# EAGLE design mwscoretransponder2017 (EAGLE 8.0.1)
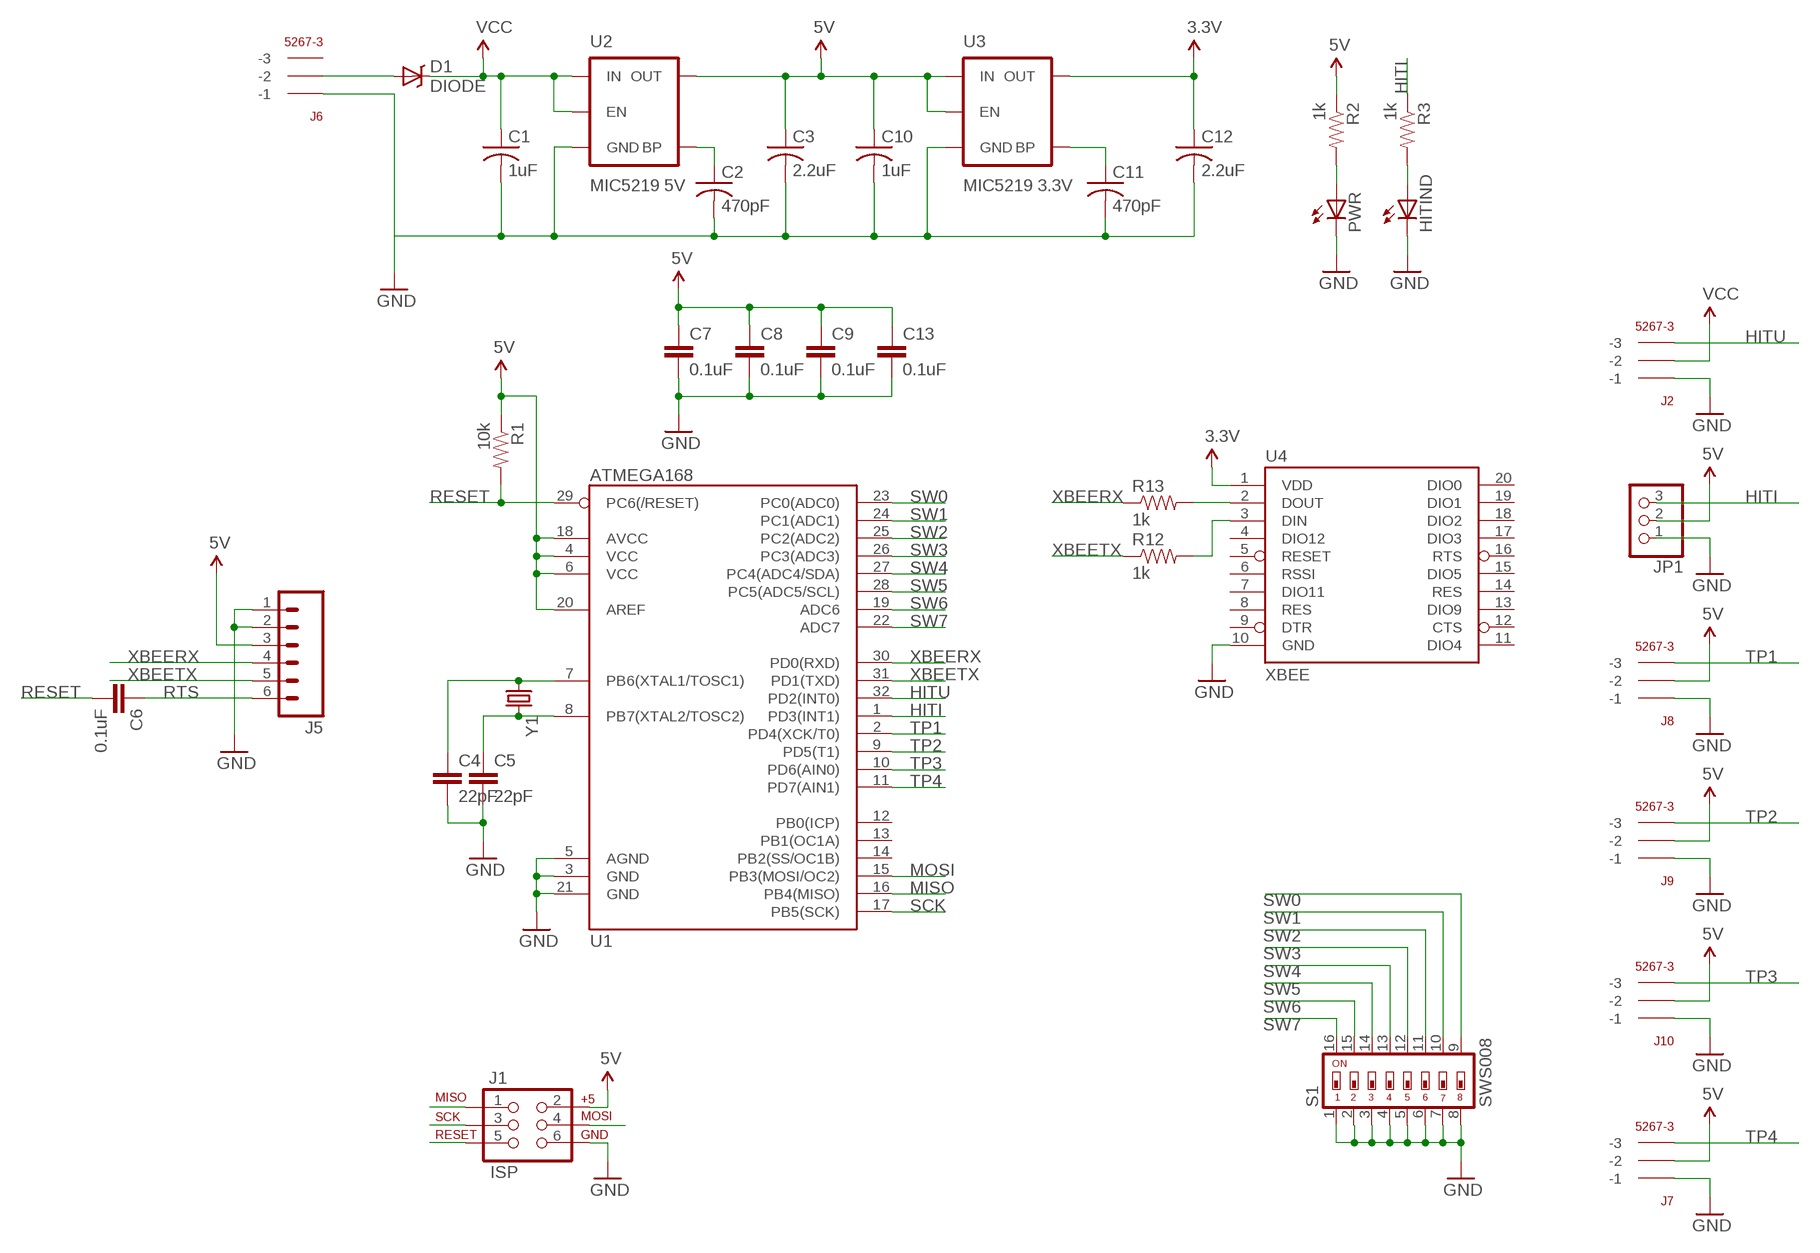
[diagram p0: schematic, sheet 1]

## Parts
C1  1uF  C-USC0603  [C0603]
C2  470pF  C-USC0603  [C0603]
C3  2.2uF  C-USC0805  [C0805]
C4  22pF  CAP0603-CAP  [0603-CAP]
C5  22pF  CAP0603-CAP  [0603-CAP]
C6  0.1uF  CAP0603-CAP  [0603-CAP]
C7  0.1uF  CAP0603-CAP  [0603-CAP]
C8  0.1uF  CAP0603-CAP  [0603-CAP]
C9  0.1uF  CAP0603-CAP  [0603-CAP]
C10  1uF  C-USC0603  [C0603]
C11  470pF  C-USC0603  [C0603]
C12  2.2uF  C-USC0805  [C0805]
C13  0.1uF  CAP0603-CAP  [0603-CAP]
D1  DIODE  DIODE-SCHOTTKY_  [SMA-DIODE]
HITIND  LED0603  [LED-0603]
J1  ISP  AVR_SPI_PRG_6PTH  [2X3]
J2  5267-3  [5267-3]
J5  M06SIP  [1X06]
J6  5267-3  [5267-3]
J7  5267-3  [5267-3]
J8  5267-3  [5267-3]
J9  5267-3  [5267-3]
J10  5267-3  [5267-3]
JP1  PINHD-1X3  [1X03]
PWR  LED0603  [LED-0603]
R1  10k  RESISTOR0603-RES  [0603-RES]
R2  1k  RESISTOR0603-RES  [0603-RES]
R3  1k  RESISTOR0603-RES  [0603-RES]
R12  1k  RESISTOR0603-RES  [0603-RES]
R13  1k  RESISTOR0603-RES  [0603-RES]
S1  SWS008  [SMS-008]
U1  ATMEGA168  [TQFP32-08]
U2  MIC5219 5V  V_REG_MIC52195V  [SOT23-5]
U3  MIC5219 3.3V  V_REG_MIC52193.3V  [SOT23-5]
U4  XBEE  XBEE-1B3  [XBEE-SMD]
Y1  CRYSTAL5X3  [CRYSTAL-SMD-5X3]

## Nets
3.3V: C12.1 U3.5(OUT) U4.1(VDD)
5V: C3.1 C7.1 C8.1 C9.1 C10.1 C13.1 J1.2 J5.3 J7.P$2(-2) J8.P$2(-2) J9.P$2(-2) J10.P$2(-2) JP1.2 R1.1 R2.1 U1.4(VCC) U1.6(VCC) U1.18(AVCC) U1.20(AREF) U2.5(OUT) U3.1(IN) U3.3(EN)
GND: C1.2 C2.2 C3.2 C4.2 C5.2 C7.2 C8.2 C9.2 C10.2 C11.2 C12.2 C13.2 HITIND.C J1.6 J2.P$1(-1) J5.1 J5.2 J6.P$1(-1) J7.P$1(-1) J8.P$1(-1) J9.P$1(-1) J10.P$1(-1) JP1.1 PWR.C S1.1 S1.2 S1.3 S1.4 S1.5 S1.6 S1.7 S1.8 U1.3(GND) U1.5(AGND) U1.21(GND) U2.2(GND) U3.2(GND) U4.10(GND)
HITI: JP1.3 R3.1 U1.1(PD3(INT1))
HITU: J2.P$3(-3) U1.32(PD2(INT0))
MISO: J1.1 U1.16(PB4(MISO))
MOSI: J1.4 U1.15(PB3(MOSI/OC2))
N$1: PWR.A R2.2
N$2: HITIND.A R3.2
N$3: C4.1 U1.7(PB6(XTAL1/TOSC1)) Y1.1
N$4: D1.A J6.P$2(-2)
N$6: C5.1 U1.8(PB7(XTAL2/TOSC2)) Y1.3
N$7: R13.2 U4.2(DOUT)
N$8: R12.2 U4.3(DIN)
N$9: C11.1 U3.4(BP)
N$11: C2.1 U2.4(BP)
RESET: C6.2 J1.5 R1.2 U1.29(PC6(/RESET))
RTS: C6.1 J5.6
SCK: J1.3 U1.17(PB5(SCK))
SW0: S1.9 U1.23(PC0(ADC0))
SW1: S1.10 U1.24(PC1(ADC1))
SW2: S1.11 U1.25(PC2(ADC2))
SW3: S1.12 U1.26(PC3(ADC3))
SW4: S1.13 U1.27(PC4(ADC4/SDA))
SW5: S1.14 U1.28(PC5(ADC5/SCL))
SW6: S1.15 U1.19(ADC6)
SW7: S1.16 U1.22(ADC7)
TP1: J8.P$3(-3) U1.2(PD4(XCK/T0))
TP2: J9.P$3(-3) U1.9(PD5(T1))
TP3: J10.P$3(-3) U1.10(PD6(AIN0))
TP4: J7.P$3(-3) U1.11(PD7(AIN1))
VCC: C1.1 D1.C J2.P$2(-2) U2.1(IN) U2.3(EN)
XBEERX: J5.4 R13.1 U1.30(PD0(RXD))
XBEETX: J5.5 R12.1 U1.31(PD1(TXD))
Unconnected: J6.P$3(-3) U1.12(PB0(ICP)) U1.13(PB1(OC1A)) U1.14(PB2(SS/OC1B)) U4.4(DIO12) U4.5(RESET) U4.6(RSSI) U4.7(DIO11) U4.8(RES) U4.9(DTR) U4.11(DIO4) U4.12(CTS) U4.13(DIO9) U4.14(RES) U4.15(DIO5) U4.16(RTS) U4.17(DIO3) U4.18(DIO2) U4.19(DIO1) U4.20(DIO0)

## Library data of the parts
C1-C3 C10-C12 = rcl:C-US: CAPACITOR, American symbol
C4-C9 C13 = SparkFun:CAP: Capacitor Standard 0603 ceramic capacitor, and 0.1" leaded capacitor.
D1 = SparkFun:DIODE-SCHOTTKY
HITIND PWR = SparkFun:LED: LEDs Standard schematic elements and footprints for 5mm, 3mm, 1206, and 0603 sized LEDs. 5mm - Spark Fun Electronics SKU : COM-00529 (and others)
J1 = SparkFun:AVR_SPI_PRG_6: AVR ISP 6 Pin This is the reduced ISP connector for AVR programming. Common on Arduino. This footprint will take up less PCB space and can be used with a 10-pin to 6-pin adapter such as SKU: BOB-08508
J2 J6-J10 = con-molex-spox:5267-3
J5 = SparkFun:M06: Header 6 Standard 6-pin 0.1" header. Use with straight break away headers (SKU : PRT-00116), right angle break away headers (PRT-00553), swiss pins (PRT-00743), machine pins (PRT-00117), and female headers (PRT-00115). Molex polarized connector foot print use with SKU : PRT-08094 with associated crimp pins and housings. NOTES ON THE VARIANTS LOCK and LOCK_LONGPADS... This footprint was designed to help hold the alignment of a through-hole component (i.e. 6-pin header) while soldering it into place. You may notice that each hole has been shifted either up or down by 0.005 of an inch from it's more standard position (which is a perfectly straight line). This slight alteration caused the pins (the squares in the middle) to touch the edges of the holes. Because they are alternating, it causes a "brace" to hold the component in place. 0.005 has proven to be the perfect amount of "off-center" position when using our standard breakaway headers. Although looks a little odd when you look at the bare footprint, once you have a header in there, the alteration is very hard to notice. Also, if you push a header all the way into place, it is covered up entirely on the bottom side. This idea of altering the position of holes to aid alignment will be further integrated into the Sparkfun Library for other footprints. It can help hold any component with 3 or more connection pins.
JP1 = pinhead:PINHD-1X3: PIN HEADER
R1-R3 R12 R13 = SparkFun:RESISTOR: Resistor Basic schematic elements and footprints for 0603, 1206, and PTH resistors.
S1 = smd-special:SWS008: SMD Dip Switch 8 pol.
U1 = SparkFun:ATMEGA168
U2 = SparkFun-PowerIC:V_REG_MIC5219: V_REG MIC5219 Standard 3.3V and 5V 500mA LDO voltage regulator in SOT-23 layout. Micrel part MIC5219. BP (by-pass) pin is used to lower output noise with 470pF cap, may be left open.; PROD_ID: VREG-10107
U3 = SparkFun-PowerIC:V_REG_MIC5219: V_REG MIC5219 Standard 3.3V and 5V 500mA LDO voltage regulator in SOT-23 layout. Micrel part MIC5219. BP (by-pass) pin is used to lower output noise with 470pF cap, may be left open.; PROD_ID: VREG-09872
U4 = SparkFun:XBEE-1
Y1 = SparkFun:CRYSTAL: Crystals Various standard crystals. Proven footprints. Spark Fun Electronics SKU : COM-00534

## Board
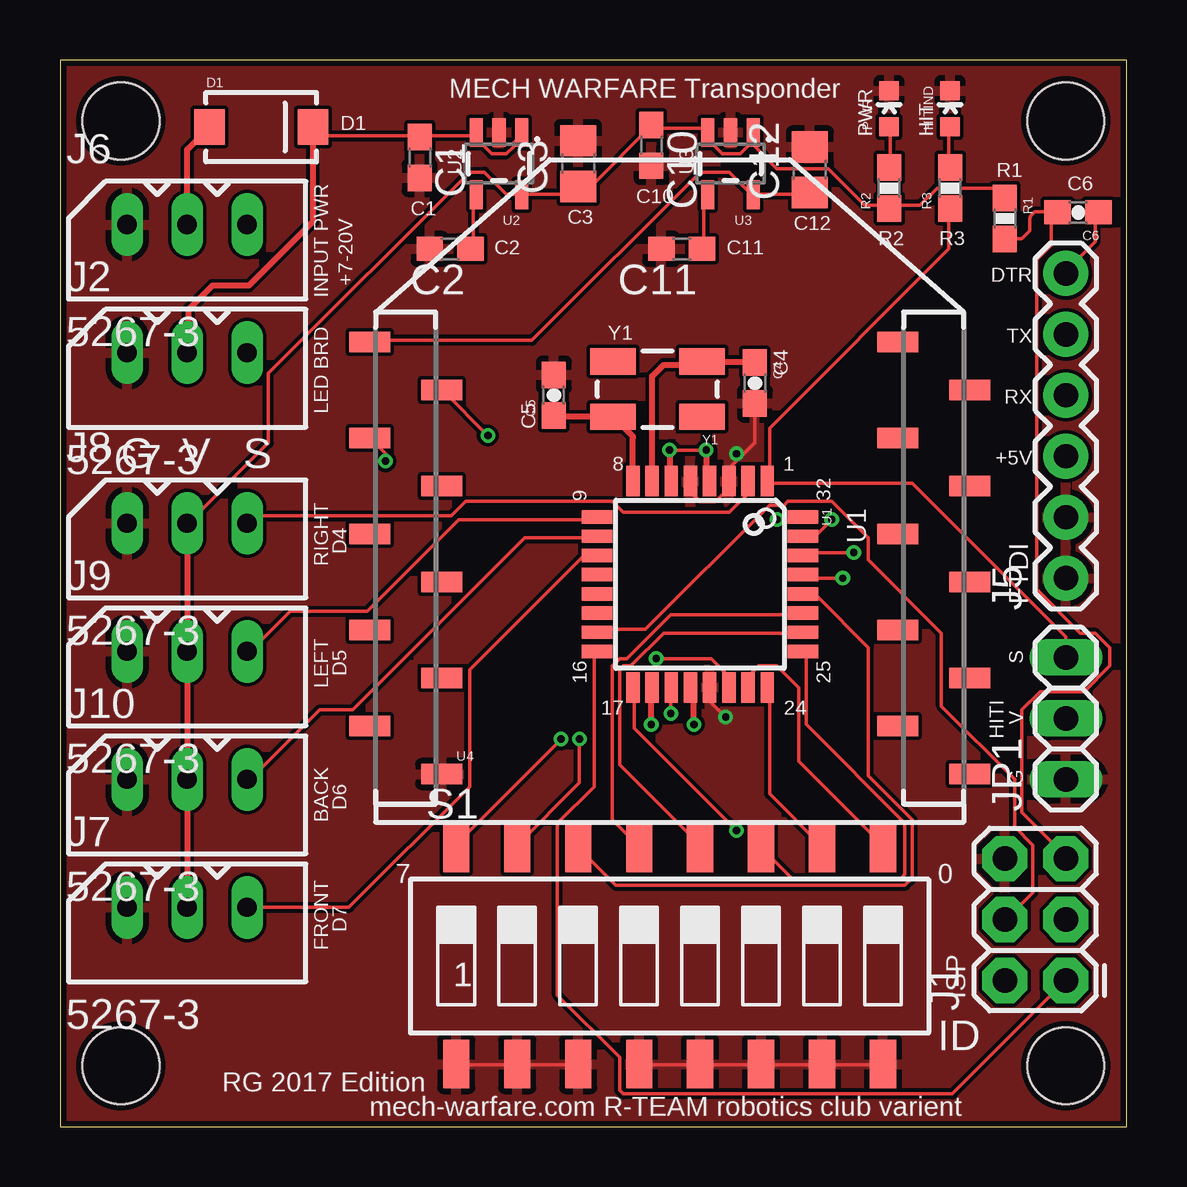
[diagram p1: board, top side]
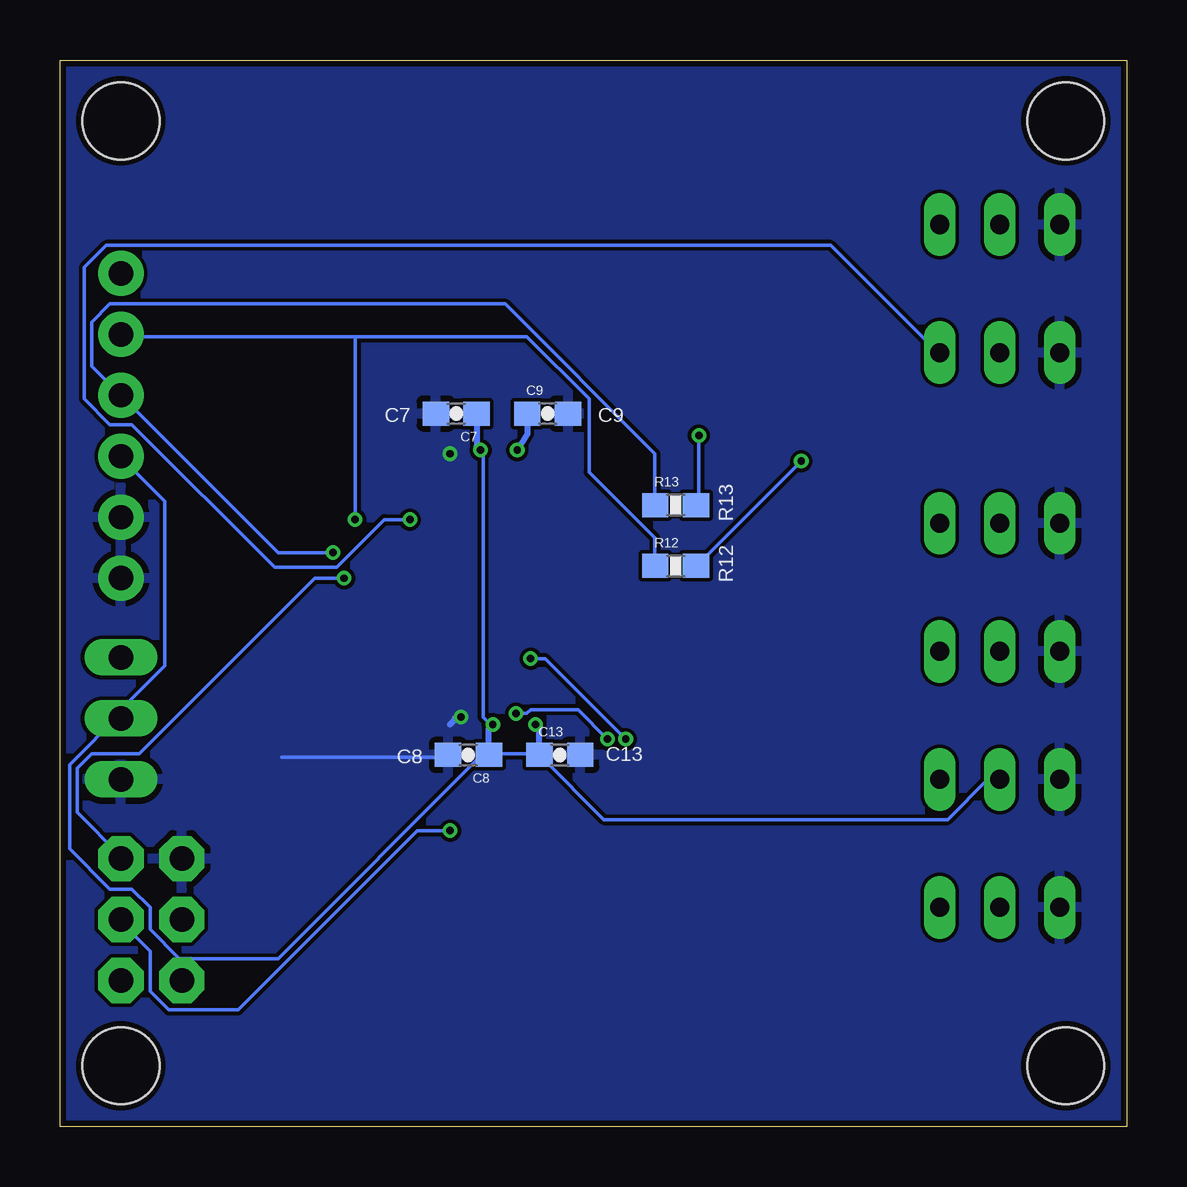
[diagram p2: board, bottom side, seen from below]

Size 44.45 x 44.45 mm. Coordinates in mm from the lower left corner, seen from the top.
Outline: 0,0 44.45,0 44.45,44.45 0,44.45 0,0
Copper layers (1*16): Top 0.035mm / dielectric 1.5mm / Bottom 0.035mm
Design rules "default": minimum track width 6mil, minimum drill 12mil, track to track 6mil, track to pad 6mil, pad to pad 6mil, via to via 6mil, smd to smd 0mil, copper to edge 10mil, drill to drill 10mil, minimum pad ring 10mil, minimum via ring 6mil, stop-mask expansion 2mil, vias tented up to drill 100mil, thermal gap 10mil
Holes 3.2 mm at 2.54,2.54 41.91,2.54 2.54,41.91 41.91,41.91

### Footprints (pad centres in the part's own frame; a part is rotated, then mirrored left to right if it is on the bottom)
C0603 = smd 1.1 x 1: 1 -0.85,0; 2 0.85,0
C0805 = smd 1.3 x 1.5: 1 -0.95,0; 2 0.95,0
0603-CAP = smd 1.1 x 1: 1 -0.85,0; 2 0.85,0
SMA-DIODE = smd 1.27 x 1.47: A -2.15,0; C 2.15,0
LED-0603 = smd 0.8 x 0.8: A 0,-0.75; C 0,0.75
2X3 = drill 1.016 pad 1.88 octagon: 1 0,0; 2 0,2.54; 3 2.54,0; 4 2.54,2.54; 5 5.08,0; 6 5.08,2.54
5267-3 = drill 0.8 long: P$1 0,0; P$2 2.5,0; P$3 5,0
1X06 = drill 1.016 pad 1.88: 1 0,0; 2 2.54,0; 3 5.08,0; 4 7.62,0; 5 10.16,0; 6 12.7,0
1X03 = drill 1.016 long: 1 -2.54,0; 2 0,0; 3 2.54,0
0603-RES = smd 1.1 x 1: 1 -0.85,0; 2 0.85,0
SMS-008 = smd 1.092 x 2.007: 1 -8.89,-4.496; 2 -6.35,-4.496; 3 -3.81,-4.496; 4 -1.27,-4.496; 5 1.27,-4.496; 6 3.81,-4.496; 7 6.35,-4.496; 8 8.89,-4.496; 9 8.89,4.496; 10 6.35,4.496; 11 3.81,4.496; 12 1.27,4.496; 13 -1.27,4.496; 14 -3.81,4.496; 15 -6.35,4.496; 16 -8.89,4.496
TQFP32-08 = smd 1.27 x 0.559: 1 -4.293,2.8; 2 -4.293,2; 3 -4.293,1.2; 4 -4.293,0.4; 5 -4.293,-0.4; 6 -4.293,-1.2; 7 -4.293,-2; 8 -4.293,-2.8; 17 4.293,-2.8; 18 4.293,-2; 19 4.293,-1.2; 20 4.293,-0.4; 21 4.293,0.4; 22 4.293,1.2; 23 4.293,2; 24 4.293,2.8 | smd 0.559 x 1.27: 9 -2.8,-4.293; 10 -2,-4.293; 11 -1.2,-4.293; 12 -0.4,-4.293; 13 0.4,-4.293; 14 1.2,-4.293; 15 2,-4.293; 16 2.8,-4.293; 25 2.8,4.293; 26 2,4.293; 27 1.2,4.293; 28 0.4,4.293; 29 -0.4,4.293; 30 -1.2,4.293; 31 -2,4.293; 32 -2.8,4.293
SOT23-5 = smd 0.55 x 1.2: 1 -0.95,-1.3; 2 0,-1.3; 3 0.95,-1.3; 4 0.95,1.3; 5 -0.95,1.3
XBEE-SMD = smd 1.7 x 0.85: 1 -12.5,20; 2 -9.5,18; 3 -12.5,16; 4 -9.5,14; 5 -12.5,12; 6 -9.5,10; 7 -12.5,8; 8 -9.5,6; 9 -12.5,4; 10 -9.5,2; 11 12.5,2; 12 9.5,4; 13 12.5,6; 14 9.5,8; 15 12.5,10; 16 9.5,12; 17 12.5,14; 18 9.5,16; 19 12.5,18; 20 9.5,20
CRYSTAL-SMD-5X3 = smd 1.9 x 1.1: 1 -1.85,-1.15; 2 1.85,-1.15; 3 1.85,1.15; 4 -1.85,1.15

### Placement (x,y rotation side)
C1  14.99,40.39 270 top
C2  16.26,36.58 180 top
C3  21.59,40.13 90 top
C4  28.96,30.99 270 top
C5  20.57,30.48 90 top
C6  42.42,38.1 180 top
C7  27.94,29.72 180 bottom
C8  27.43,15.49 180 bottom
C9  24.13,29.72 0 bottom
C10  24.64,40.89 270 top
C11  25.91,36.58 180 top
C12  31.24,39.88 90 top
C13  23.62,15.49 0 bottom
D1  8.38,41.66 0 top
HITIND  37.08,42.42 0 top
J1  41.91,6.1 90 top
J2  2.79,32.26 0 top
J5  41.91,22.86 90 top
J6  2.79,37.59 0 top
J7  2.79,9.14 0 top
J8  2.79,25.15 0 top
J9  2.79,19.81 0 top
J10  2.79,14.48 0 top
JP1  41.91,17.02 90 top
PWR  34.54,42.42 0 top
R1  39.37,37.85 270 top
R2  34.54,39.12 90 top
R3  37.08,39.12 90 top
R12  18.8,23.37 0 bottom
R13  18.8,25.91 0 bottom
S1  25.4,7.11 0 top
U1  26.67,22.61 270 top
U2  18.29,40.13 180 top
U3  27.94,40.13 180 top
U4  25.4,12.7 0 top
Y1  24.89,30.73 180 top

### Tracks (layer width: path | path; a pad name or v marks a point on that pad's centre or on a via)
3.3V
  Top 0.152: C12.1 31.24,38.86 28.96,38.86 U3.5 28.8,38.86 27.89,39.78 26.67,39.78 19.66,32.77 12.95,32.77 U4.1
5V  (via drill 0.3)
  Top 0.152: 28.8,41 28.8,41.3 U3.1 28.8,41 | 28.8,41 28.35,40.54 27.58,40.54 27.13,41 27.13,41.3 U3.3 26.98,41.45 26.82,41.6 24.69,41.6 C10.1 24.54,41.6 22.25,39.32 21.64,39.32 C3.1 21.49,39.17 21.18,38.86 19.36,38.86 U2.5 19.2,38.86 18.59,38.86 17.68,39.78 17.07,39.78 8.69,31.39 8.69,28.5 5.33,25.15 J8.P$2 | 28.8,41 29.87,39.93 32,39.93 33.53,38.41 34.44,38.41 R2.1 34.59,38.41 35.81,38.41 36.55,39.12 38.79,39.12 arc-45 38.97,39.04 R1.1 | v25.4,28.19 v26.92,28.19
  Top 0.254: J8.P$2 J9.P$2 J10.P$2 J7.P$2 | v26.42,16.76 26.42,18.17 U1.20 | v24.64,16.76 24.64,18.28 U1.18 | v25.4,28.19 25.4,26.97 U1.6 | v26.92,28.19 26.92,27.05 U1.4
  Bottom 0.152: v26.92,28.19 26.82,28.19 26.82,17.07 26.52,16.76 v26.42,16.76 | 41.91,17.22 41.91,17.37 40.08,19.2 40.08,26.06 41.91,27.89 J5.3 | 41.91,17.22 JP1.2 41.91,17.07 | 39.47,7.01 39.47,6.1 J1.2 39.47,7.01 | 39.47,7.01 40.69,8.23 40.69,9.14 41.45,9.91 42.37,9.91 44.04,11.58 44.04,15.09 41.91,17.22 | 39.47,7.01 35.36,7.01 26.98,15.39 26.67,15.39 C8.1 26.52,15.54 24.54,15.54 C13.1 24.38,15.39 21.79,12.8 7.47,12.8 5.79,14.48 J10.P$2
  Bottom 0.254: C8.1 26.58,16.6 v26.42,16.76 | C13.1 24.47,16.6 v24.64,16.76 | C9.1 24.98,28.87 v25.4,28.19 | C7.1 27.09,28.36 v26.92,28.19
GND  (via drill 0.3)
  Top 0.152: 15.85,14.78 U4.10 | U1.5 26.04,26.67 26.67,26.04 27.3,26.04 27.94,26.67 27.9,26.83 | 27.9,26.83 27.88,26.91 | C4.2 28.96,28.5 28.35,27.89 | 28.35,27.89 27.89,27.43 27.89,26.98 U1.3 27.89,26.82 27.9,26.83 | v27.74,17.07 27.13,17.68 27.13,18.29 U1.21 | 26.67,2.59 24.23,2.59 S1.4 | S1.8 34.29,2.59 31.85,2.59 S1.7 31.7,2.59 29.26,2.59 S1.6 29.11,2.59 26.67,2.59 | 26.67,2.59 S1.5 | v28.19,28.04 28.35,27.89 | 19.05,2.59 16.61,2.59 S1.1 | 19.05,2.59 21.49,2.59 S1.3 | 19.05,2.59 S1.2
  Bottom 0.152: v27.74,17.07 27.89,17.07 27.94,17.02 | 28.04,17.07 27.96,16.99 | 35.2,15.39 28.35,15.39 C8.2 | 39.32,11.28 J1.6 | 28.04,28.04 v28.19,28.04
  Bottom 0.254: 27.94,17.02 27.96,16.99 28.19,16.76 | 28.19,15.58 C8.2
  pour Bottom: -0.25,44.7 44.96,44.7 44.96,-0.51 -0.25,-0.51
  pour Top: -0.25,44.7 44.7,44.7 44.7,-0.25 -0.25,-0.25
HITI
  Top 0.152: R3.1 37.03,38.25 37.03,36.58 29.57,29.11 29.57,26.98 U1.1 29.57,26.82 35.51,26.82 41.91,20.42 JP1.3
HITU  (via drill 0.3)
  Top 0.152: v29.87,25.3 30.94,25.3 U1.32
  Bottom 0.152: v29.87,25.3 30.94,25.3 32.92,23.32 35.51,23.32 41.45,29.26 42.37,29.26 43.43,30.33 43.43,35.81 42.52,36.73 12.34,36.73 7.92,32.31 J2.P$3
MISO
  Top 0.152: J1.1 37.19,1.37 23.47,1.37 23.32,1.52 23.32,2.9 20.73,5.49 20.73,12.65 22.25,14.17 22.25,19.66 U1.16
MOSI
  Top 0.152: U1.15 22.4,20.73 24.38,20.73 29.57,25.91 30.18,25.91 30.33,26.06 32.16,26.06 33.68,24.54 33.68,23.62 36.73,20.57 36.73,17.53 39.78,14.48 39.78,12.5 40.54,11.73 40.54,9.75 39.47,8.69 J1.4
N$1
  Top 0.152: PWR.A 34.59,41.6 34.59,40.08 R2.2
N$2
  Top 0.152: HITIND.A 37.03,41.6 37.03,40.08 R3.2
N$3
  Top 0.254: U1.7 24.67,31.27 25.15,31.75 26.61,31.75 Y1.1 28.91,31.88 C4.1
N$4
  Top 0.254: J6.P$2 5.29,40.72 D1.A
N$6
  Top 0.254: U1.8 23.87,28.7 23.88,28.7 23.88,28.75 Y1.3 20.62,29.58 C5.1
N$7  (via drill 0.3)
  Top 0.152: v17.83,28.8 16,30.63 U4.2
  Bottom 0.152: v17.83,28.8 17.83,25.91 R13.2
N$8  (via drill 0.3)
  Top 0.152: v13.56,27.74 13.56,28.04 12.95,28.65 U4.3
  Bottom 0.152: v13.56,27.74 17.83,23.47 R12.2
N$9
  Top 0.152: C11.1 26.82,36.58 26.82,38.56 26.98,38.71 U3.4
N$11
  Top 0.152: C2.1 17.22,36.58 17.22,38.71 U2.4
RESET  (via drill 0.3)
  Top 0.152: v32.61,22.86 31.09,22.86 U1.29 | C6.2 41.3,38.1 41.3,36.73 40.69,36.12 40.69,22.4 42.52,20.57 43.13,20.57 43.74,19.96 43.74,19.2 42.67,18.14 40.84,18.14 40.08,17.37 40.08,13.11 41.91,11.28 J1.5 | R1.2 39.96,37 arc45 40.14,37.07 40.41,37.34 40.41,37.82 arc-45 40.49,38 40.62,38.12 41.51,38.12
  Top 0.254: 41.51,38.12 arc-45 C6.2
  Bottom 0.152: v32.61,22.86 33.83,22.86 41.15,15.54 43.13,15.54 43.74,14.94 43.74,13.11 41.91,11.28 J1.5
RTS
  Top 0.152: C6.1 43.13,38.1 43.13,36.88 41.91,35.66 J5.6
SCK  (via drill 0.3)
  Top 0.152: v28.19,12.34 23.93,16.61 23.93,18.29 U1.17
  Bottom 0.152: v28.19,12.34 29.57,12.34 37.03,4.88 39.93,4.88 40.69,5.64 40.69,7.32 41.91,8.53 J1.3
SW0
  Top 0.152: U1.23 28.8,18.44 28.8,18.9 29.11,19.2 29.87,19.2 30.79,18.29 30.79,15.24 34.29,11.73 S1.9
SW1
  Top 0.152: U1.24 29.57,18.29 29.57,13.87 31.7,11.73 S1.10
SW2
  Top 0.152: U1.25 31.09,19.66 31.09,16.76 35.2,12.65 35.2,10.52 35.05,10.36 30.48,10.36 29.26,11.58 S1.11
SW3
  Top 0.152: U1.26 30.94,20.57 25.15,20.57 23.77,19.2 23.47,19.2 23.32,19.05 23.32,15.09 26.67,11.73 S1.12
SW4
  Top 0.152: U1.27 30.94,21.34 25.45,21.34 23.62,19.51 23.32,19.51 23.01,19.2 23.01,12.8 24.08,11.73 S1.13
SW5
  Top 0.152: U1.28 31.09,22.1 31.55,22.1 33.68,19.96 33.68,14.63 35.51,12.8 35.51,10.36 35.2,10.06 23.16,10.06 21.64,11.58 S1.14
SW6  (via drill 0.3)
  Top 0.152: v25.45,17.22 25.45,18.29 U1.19 | v21.64,16.15 21.64,14.33 19.05,11.73 S1.15
  Bottom 0.152: v25.45,17.22 24.99,17.22 24.84,17.37 22.86,17.37 v21.64,16.15
SW7  (via drill 0.3)
  Top 0.152: v24.84,19.51 27.13,19.51 27.74,18.9 27.74,18.44 U1.22 | v20.88,16.15 16.46,11.73 S1.16
  Bottom 0.152: v24.84,19.51 24.23,19.51 v20.88,16.15
TP1
  Top 0.152: U1.2 28.65,26.82 28.65,26.36 27.89,25.6 23.47,25.6 23.01,26.06 16.92,26.06 16.31,25.45 8.23,25.45 7.92,25.15 J8.P$3
TP2
  Top 0.152: U1.9 22.25,25.3 16.61,25.3 12.8,21.49 9.6,21.49 7.92,19.81 J9.P$3
TP3
  Top 0.152: U1.10 22.25,24.54 19.36,24.54 12.19,17.37 10.82,17.37 7.92,14.48 J10.P$3
TP4
  Top 0.152: J7.P$3 12.04,9.14 17.07,14.17 17.07,19.05 21.79,23.77 22.25,23.77 U1.11
VCC
  Top 0.152: 17.22,41.3 15.09,41.3 C1.1 14.94,41.3 10.52,41.3 D1.C | 17.22,41.3 17.98,40.54 18.59,40.54 18.9,40.84 18.9,41 19.2,41.3 U2.1 | 17.22,41.3 U2.3
  Top 0.254: D1.C 10.53,37.71 7.87,35.05 6.35,35.05 5.33,34.04 5.33,32.3 J2.P$2
XBEERX  (via drill 0.3)
  Top 0.152: v33.07,23.93 31.09,23.93 U1.30
  Bottom 0.152: R13.1 19.66,28.04 25.91,34.29 42.37,34.29 43.13,33.53 43.13,31.7 J5.4 35.36,23.93 v33.07,23.93
XBEETX  (via drill 0.3)
  Top 0.152: v32.16,25.3 31.55,24.69 31.09,24.69 U1.31
  Bottom 0.152: 32.16,32.92 41.91,32.92 J5.5 | 32.16,32.92 24.99,32.92 22.4,30.33 22.4,27.28 19.66,24.54 19.66,23.47 R12.1 | 32.16,32.92 v32.16,25.3

### Text on the board
tsilk: MECH WARFARE Transponder | D1 | U2 | U3 | PWR | HIT | R1 | C6 | C1 | C3 | C10 | C12 | C2 | C11 | R2 | R3 | DTR | INPUT PWR | +7-20V | Y1 | TX | C4 | RX | LED BRD | C5 | 8 | 1 | +5V | G | V | S | 9 | 32 | U1 | D4 | RIGHT | FTDI | D5 | 16 | 25 | S | LEFT | 17 | 24 | V | HITI | G | BACK | D6 | 7 | 0 | D7 | FRONT | ISP | ID | RG 2017 Edition | mech-warfare.com R-TEAM robotics club varient
bsilk: C9 | C7 | R13 | R12 | C8 | C13